# Altium schematic sheet GregTrack_BIG_SENS_v1_0.SchDoc: PCA10090 - nRF9160
size A3; Organization: Nordic Semiconductor; DocumentNumber: 2; SheetNumber: 2; SheetTotal: 8; CompanyName: Nordic Semiconductor; DocumentSize: A3
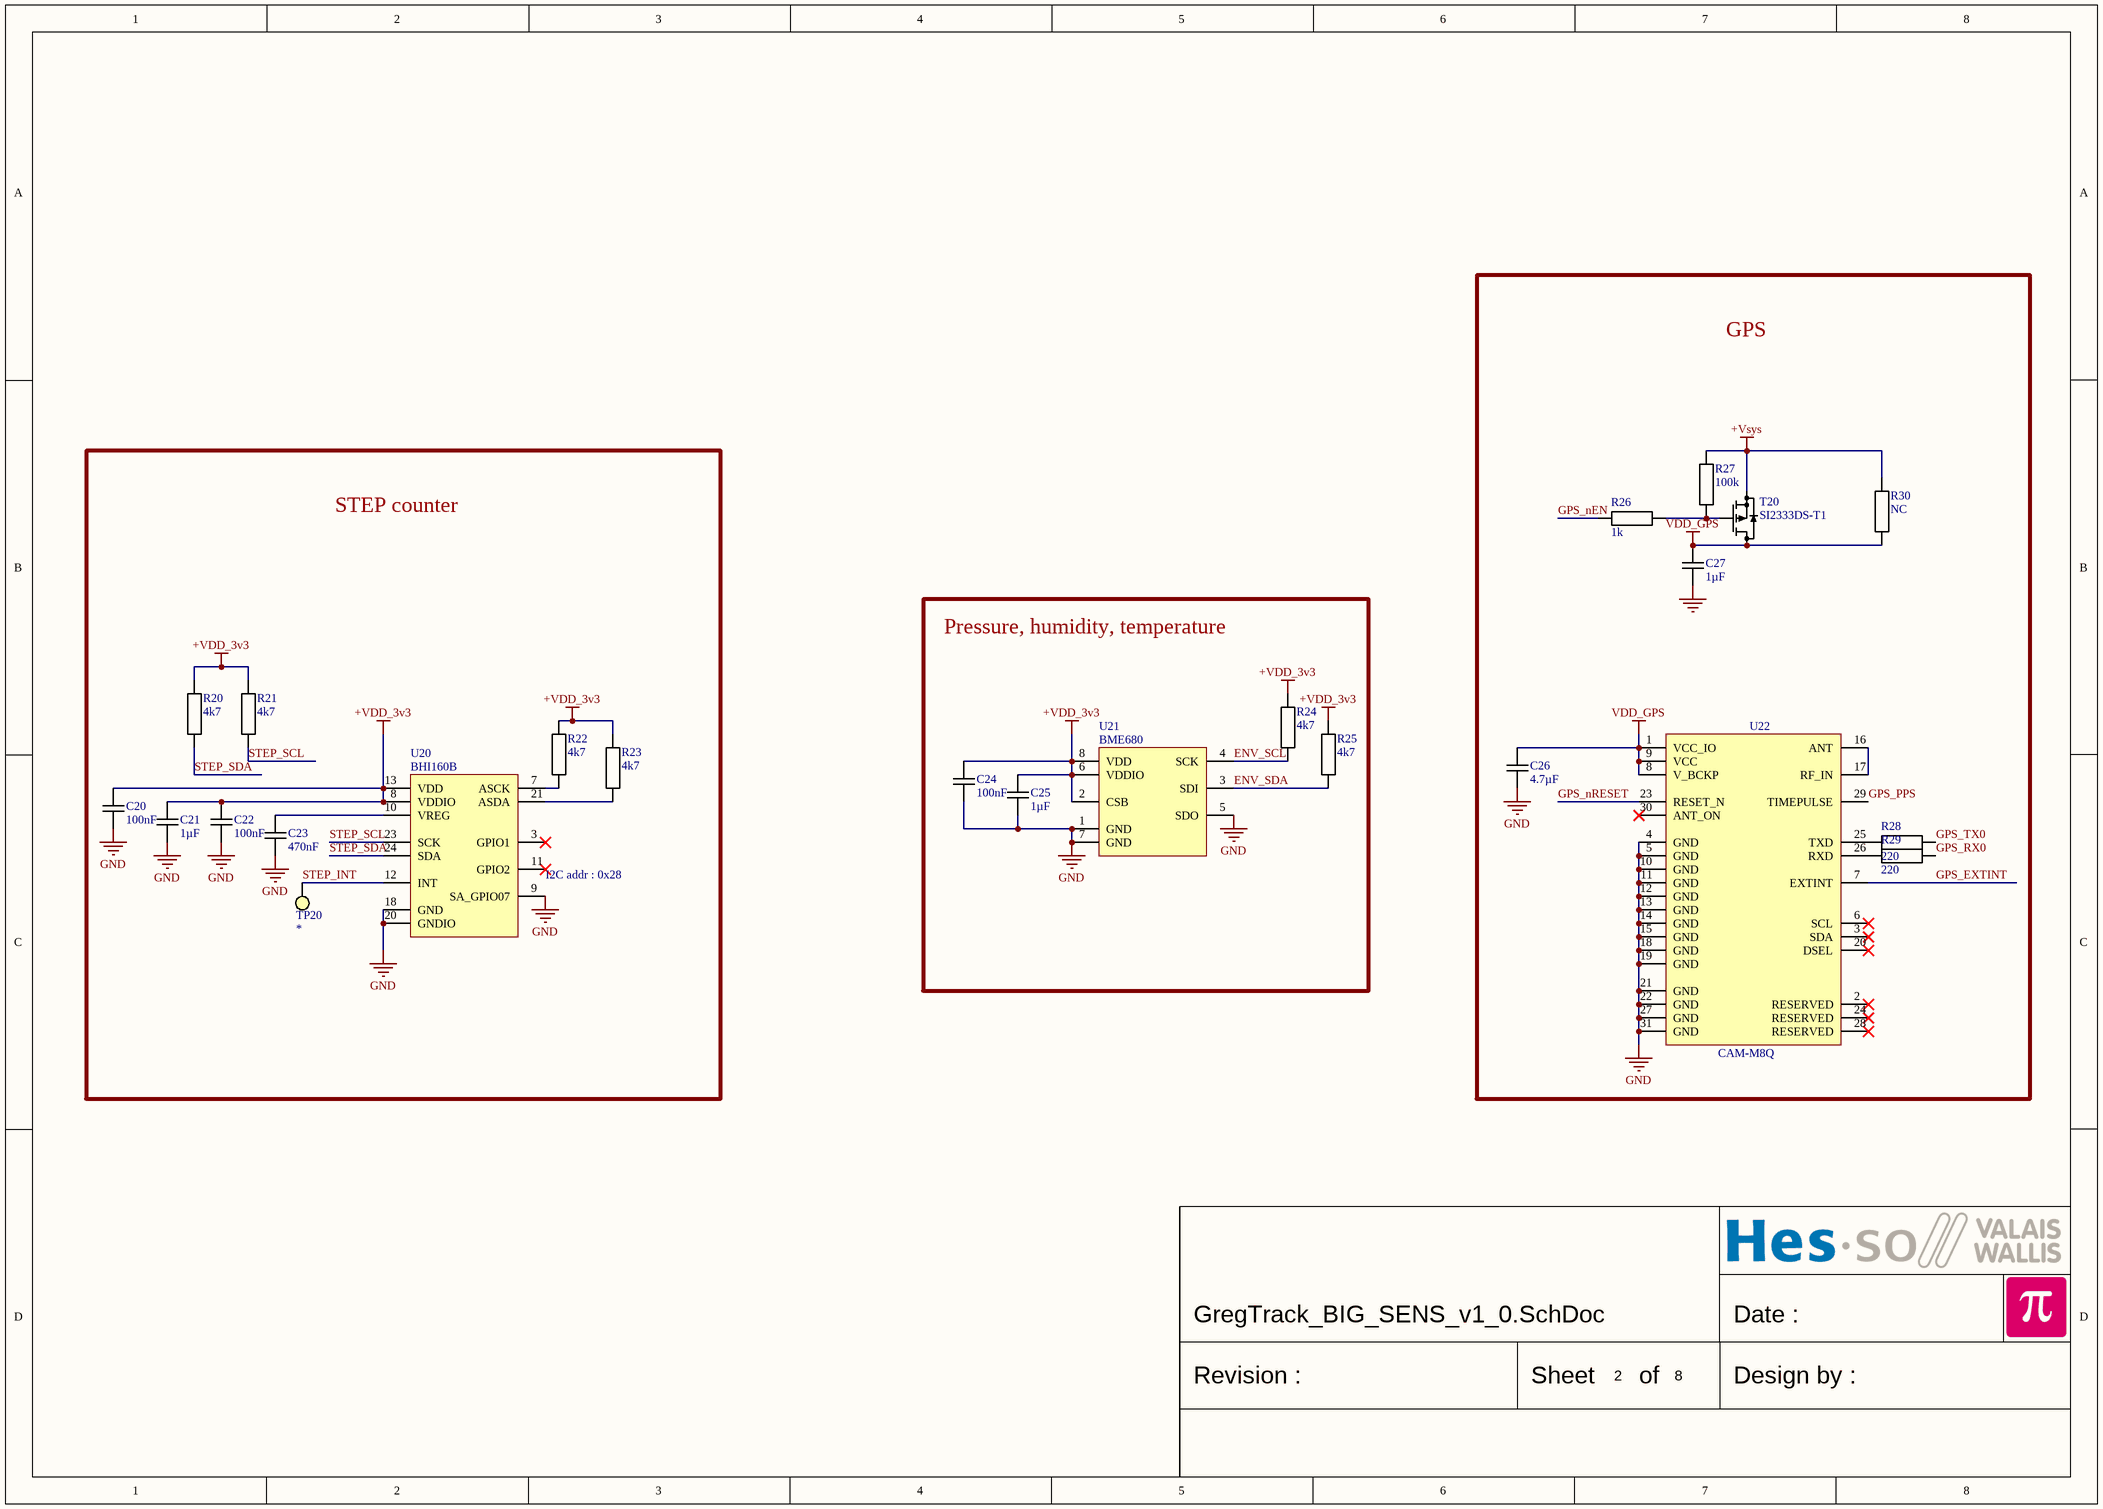
[diagram p0: GregTrack_BIG_SENS_v1_0.SchDoc]

## Parts
C20  100nF  [CAPACITOR 1005 REFLOW]
C21  1µF  [CAPACITOR 1005 REFLOW]
C22  100nF  [CAPACITOR 1005 REFLOW]
C23  470nF  [CAPACITOR 1005 REFLOW]
C24  100nF  [CAPACITOR 1005 REFLOW]
C25  1µF  [CAPACITOR 1005 REFLOW]
C26  4.7µF  [CAPACITOR 1608 REFLOW]
C27  1µF  [CAPACITOR 1005 REFLOW]
R20  4k7  [RESISTOR 1005 REFLOW]
R21  4k7  [RESISTOR 1005 REFLOW]
R22  4k7  [RESISTOR 1005 REFLOW]
R23  4k7  [RESISTOR 1005 REFLOW]
R24  4k7  [RESISTOR 1005 REFLOW]
R25  4k7  [RESISTOR 1005 REFLOW]
R26  1k  [RESISTOR 1005 REFLOW]
R27  100k  [RESISTOR 1005 REFLOW]
R28  220  [RESISTOR 1005 REFLOW]
R29  220  [RESISTOR 1005 REFLOW]
R30  NC  [RESISTOR 1005 REFLOW]
T20  SI2333DS-T1  [SOT23 P0.95 C1.6x3.0 H1.3]
TP20  *  [Pad D0.8]  (no BOM)
U20  BHI160B  [BHI160b]
U21  BME680  [BME680]
U22  CAM-M8Q  [CAM-M8Q]

## Blocks framed on the sheet
GPS: C26 C27 R26-R30 T20 U22
STEP counter: C20-C23 R20-R23 TP20 U20
Pressure, humidity, temperature: C24 C25 R24 R25 U21

## Nets
+VDD_3v3: C20.2 C21.2 C22.2 C24.2 C25.2 R20.1 R21.1 R22.2 R23.2 R24.1 R25.1 U20.8(VDDIO) U20.13(VDD) U21.2(CSB) U21.6(VDDIO) U21.8(VDD)
+Vsys: R27.1 R30.1 T20.2(S)
GND: C20.1 C21.1 C22.1 C23.1 C24.1 C25.1 C26.2 C27.2 U20.9(SA_GPIO07) U20.18(GND) U20.20(GNDIO) U21.1(GND) U21.5(SDO) U21.7(GND) U22.4(GND) U22.5(GND) U22.10(GND) U22.11(GND) U22.12(GND) U22.13(GND) U22.14(GND) U22.15(GND) U22.18(GND) U22.19(GND) U22.21(GND) U22.22(GND) U22.27(GND) U22.31(GND)
VDD_GPS: C26.1 C27.1 R30.2 T20.3(D) U22.1(VCC_IO) U22.8(V_BCKP) U22.9(VCC)
ENV_SCL: R24.2 U21.4(SCK)
ENV_SDA: R25.2 U21.3(SDI)
GPS_EXTINT: U22.7(EXTINT)
GPS_nEN: R26.1
GPS_nRESET: U22.23(RESET_N)
GPS_PPS: U22.29(TIMEPULSE)
GPS_RX0: R29.2
GPS_TX0: R28.2
STEP_INT: TP20.1 U20.12(INT)
STEP_SCL: R21.2 U20.23(SCK)
STEP_SDA: R20.2 U20.24(SDA)
NetC23_2: C23.2 U20.10(VREG)
NetR22_1: R22.1 U20.7(ASCK)
NetR23_1: R23.1 U20.21(ASDA)
NetR26_2: R26.2 R27.2 T20.1(G)
NetR28_1: R28.1 U22.25(TXD)
NetR29_1: R29.1 U22.26(RXD)
NetU22_16: U22.16(ANT) U22.17(RF_IN)

Not connected (* = marked no-connect by the designer): U20 3(GPIO1)* 11(GPIO2)*; U22 2(RESERVED)* 3(SDA)* 6(SCL)* 20(DSEL)* 24(RESERVED)* 28(RESERVED)* 30(ANT_ON)*

## Notes on the sheet
- (near U20) I2C addr : 0x28
- Date :
- Revision :
- Sheet
- of
- Design by :

## Library data of the parts
C20-C23 = Capacitor: Capacitor 1608 (0603); TempCoef: X5R; Tolerance: +/-20%; Voltage: 10V; STOCK: NO
  C20 C22: Value: 100nF
  C21: Value: 1µF
  C23: Value: 470nF
C24 C25 = Capacitor: Capacitor 1005; TempCoef: X5R; Tolerance: +/-20%; Voltage: 10V; STOCK: NO
  C24: Value: 100nF
  C25: Value: 1µF
C26 C27 = Capacitor: Capacitor 1005; Value: 1µF, 10V; TempCoef: X5R; Tolerance: 20%; Voltage: 10V; ECassembly: YES
R20 R21 R24 R25 = Resistor: Resistor 1005; Value: 4.7k; Tolerance: 1%; ECassembly: YES
R22 R23 = Resistor: Resistor 1005; Tolerance: 1%; Value: 4k7; STOCK: NO
R26 R27 R30 = Resistor: Resistor 1005; Tolerance: 1%; ECassembly: YES
  R26: Value: 1k
  R27: Value: 100k
  R30: Value: NC
R28 R29 = Resistor: Value: 220
T20 = MOS-P SOT23 G-S-D: Generic MOS-P; ECassembly: YES; Value: SI2333DS-T1
TP20 = Pad: Value: *
U20 = BHI160B: Ultra low-power sensor hub incl. integrated IMU; ECassembly: NO; Value: BHI160B
U21 = BME680: BME680Low power gas, pressure, temperature & humidity sensor; Value: BME680
U22 = CAM-M8Q: u-blox M8 concurrent GNSS antenna modules; Value: CAM-M8Q